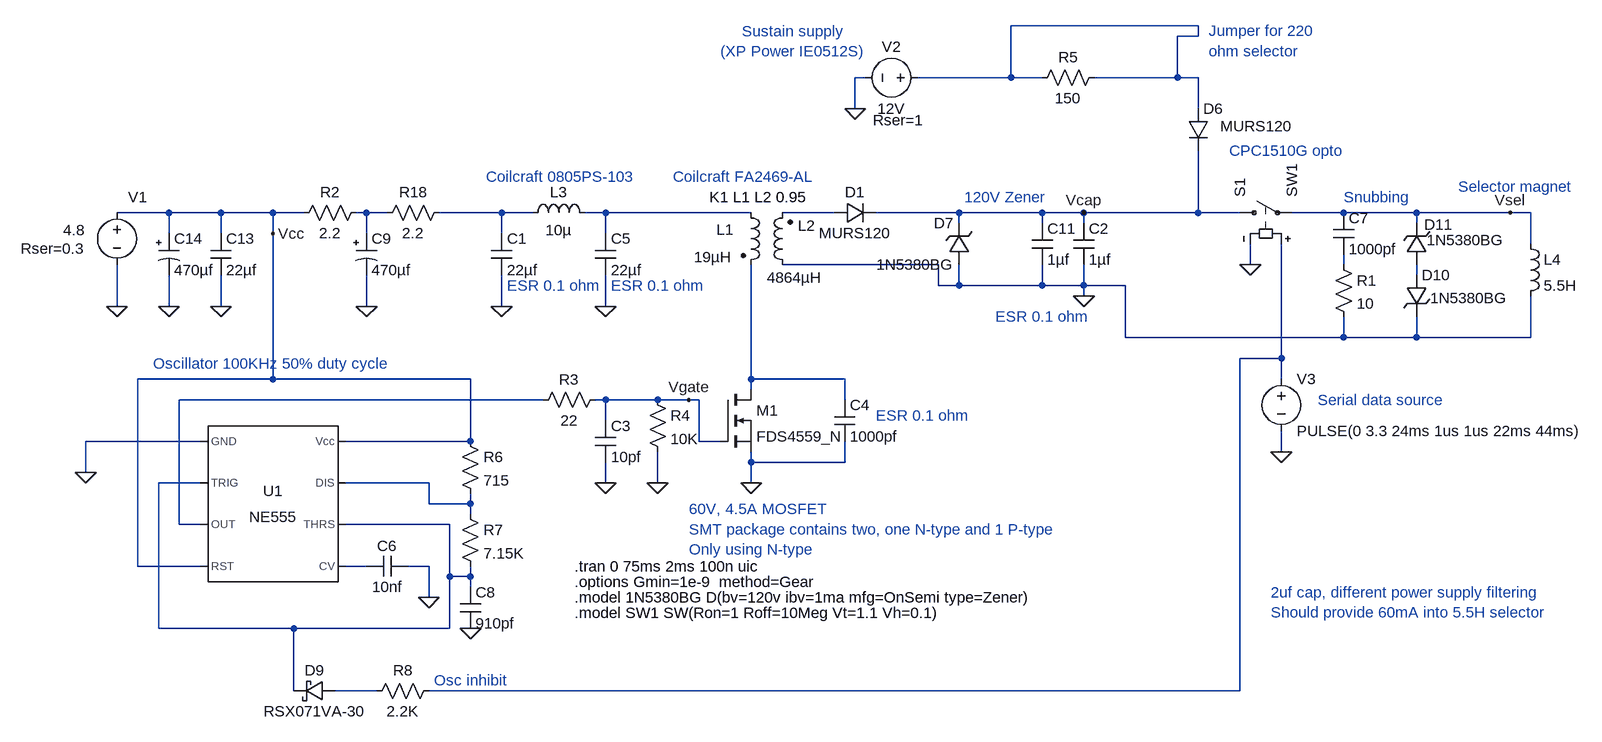
[diagram p0: schematic ttydriver.asc]
ttydriver.asc, the LTspice schematic file:
Version 4
SHEET 1 1932 744
WIRE 1264 -384 976 -384
WIRE 1264 -368 1264 -384
WIRE 1264 -368 1232 -368
WIRE 752 -304 736 -304
WIRE 976 -304 976 -384
WIRE 976 -304 832 -304
WIRE 1024 -304 976 -304
WIRE 1232 -304 1232 -368
WIRE 1232 -304 1104 -304
WIRE 1264 -304 1232 -304
WIRE 736 -256 736 -304
WIRE 1264 -256 1264 -304
WIRE -320 -96 -400 -96
WIRE -240 -96 -320 -96
WIRE -160 -96 -240 -96
WIRE -112 -96 -160 -96
WIRE -16 -96 -32 -96
WIRE 16 -96 -16 -96
WIRE 192 -96 96 -96
WIRE 240 -96 192 -96
WIRE 352 -96 320 -96
WIRE 576 -96 352 -96
WIRE 704 -96 624 -96
WIRE 896 -96 768 -96
WIRE 1024 -96 896 -96
WIRE 1088 -96 1024 -96
WIRE 1264 -96 1264 -192
WIRE 1264 -96 1088 -96
WIRE 1328 -96 1264 -96
WIRE 1488 -96 1408 -96
WIRE 1600 -96 1488 -96
WIRE 1744 -96 1600 -96
WIRE 1776 -96 1744 -96
WIRE 896 -80 896 -96
WIRE 1024 -80 1024 -96
WIRE 1088 -80 1088 -96
WIRE 1600 -80 1600 -96
WIRE -320 -64 -320 -96
WIRE -240 -64 -240 -96
WIRE -160 -64 -160 -96
WIRE -16 -64 -16 -96
WIRE 192 -64 192 -96
WIRE 352 -64 352 -96
WIRE 1776 -48 1776 -96
WIRE 864 -16 624 -16
WIRE 1344 -16 1344 -48
WIRE 1488 -16 1488 -32
WIRE 1600 0 1600 -16
WIRE 864 16 864 -16
WIRE 896 16 896 -16
WIRE 896 16 864 16
WIRE 1024 16 1024 -16
WIRE 1024 16 896 16
WIRE 1088 16 1088 -16
WIRE 1088 16 1024 16
WIRE 1152 16 1088 16
WIRE 1088 32 1088 16
WIRE -400 48 -400 -16
WIRE -320 48 -320 0
WIRE -240 48 -240 0
WIRE -16 48 -16 0
WIRE 192 48 192 0
WIRE 352 48 352 0
WIRE 1152 96 1152 16
WIRE 1488 96 1488 64
WIRE 1488 96 1152 96
WIRE 1600 96 1600 64
WIRE 1600 96 1488 96
WIRE 1776 96 1776 32
WIRE 1776 96 1600 96
WIRE 1392 128 1392 -48
WIRE 1392 128 1328 128
WIRE -160 160 -160 -64
WIRE -160 160 -368 160
WIRE 144 160 -160 160
WIRE 576 160 576 -16
WIRE 720 160 576 160
WIRE 1392 160 1392 128
WIRE 576 176 576 160
WIRE 256 192 -304 192
WIRE 352 192 336 192
WIRE 432 192 352 192
WIRE 480 192 432 192
WIRE 496 192 480 192
WIRE 720 192 720 160
WIRE 352 224 352 192
WIRE -272 256 -448 256
WIRE 144 256 144 160
WIRE 144 256 -48 256
WIRE 496 256 496 192
WIRE 528 256 496 256
WIRE 1392 272 1392 240
WIRE 576 288 576 272
WIRE 720 288 720 256
WIRE 720 288 576 288
WIRE -448 304 -448 256
WIRE -272 320 -336 320
WIRE 80 320 -48 320
WIRE 352 320 352 288
WIRE 432 320 432 272
WIRE 576 320 576 288
WIRE 80 352 80 320
WIRE 144 352 144 336
WIRE 144 352 80 352
WIRE 144 368 144 352
WIRE -304 384 -304 192
WIRE -272 384 -304 384
WIRE 112 384 -48 384
WIRE -368 448 -368 160
WIRE -272 448 -368 448
WIRE -16 448 -48 448
WIRE 80 448 48 448
WIRE 112 464 112 384
WIRE 144 464 144 448
WIRE 144 464 112 464
WIRE 144 480 144 464
WIRE 80 496 80 448
WIRE -336 544 -336 320
WIRE -128 544 -336 544
WIRE 112 544 112 464
WIRE 112 544 -128 544
WIRE -128 640 -128 544
WIRE 0 640 -64 640
WIRE 1328 640 1328 128
WIRE 1328 640 80 640
FLAG 80 496 0
FLAG -400 48 0
FLAG 1088 32 0
FLAG 1088 -96 Vcap
FLAG 576 320 0
FLAG 352 320 0
FLAG 432 320 0
FLAG 352 48 0
FLAG 192 48 0
FLAG -448 304 0
FLAG 144 544 0
FLAG 1344 -16 0
FLAG 736 -256 0
FLAG 1392 272 0
FLAG 1744 -96 Vsel
FLAG 480 192 Vgate
FLAG -160 -64 Vcc
FLAG -16 48 0
FLAG -320 48 0
FLAG -240 48 0
SYMBOL voltage -400 -112 R0
WINDOW 123 0 0 Left 2
WINDOW 39 -148 71 Left 2
WINDOW 0 17 -8 Left 2
WINDOW 3 -83 43 Left 2
SYMATTR SpiceLine Rser=0.3
SYMATTR InstName V1
SYMATTR Value 4.8
SYMBOL ind2 560 -112 R0
WINDOW 0 -37 42 Left 2
WINDOW 3 -72 84 Left 2
SYMATTR InstName L1
SYMATTR Value 19µH
SYMATTR Type ind
SYMATTR SpiceLine Rser=0.036
SYMBOL ind2 640 0 R180
WINDOW 0 -35 76 Left 2
WINDOW 3 -45 -4 Left 2
SYMATTR InstName L2
SYMATTR Value 4864µH
SYMATTR Type ind
SYMATTR SpiceLine Rser=16.5
SYMBOL diode 704 -80 R270
WINDOW 0 32 32 VTop 2
WINDOW 3 0 32 VBottom 2
SYMATTR InstName D1
SYMATTR Value MURS120
SYMBOL cap 1072 -80 R0
SYMATTR InstName C2
SYMATTR Value 1µf
SYMATTR SpiceLine Rser=0.1
SYMBOL nmos 528 176 R0
SYMATTR InstName M1
SYMATTR Value FDS4559_N
SYMBOL cap 704 192 R0
SYMATTR InstName C4
SYMATTR Value 1000pf
SYMATTR SpiceLine Rser=0.1
SYMBOL res -16 -112 R90
WINDOW 0 0 56 VBottom 2
WINDOW 3 32 56 VTop 2
SYMATTR InstName R2
SYMATTR Value 2.2
SYMBOL res 416 176 R0
SYMATTR InstName R4
SYMATTR Value 10K
SYMBOL res 352 176 R90
WINDOW 0 0 56 VBottom 2
WINDOW 3 32 56 VTop 2
SYMATTR InstName R3
SYMATTR Value 22
SYMBOL cap 336 224 R0
SYMATTR InstName C3
SYMATTR Value 10pf
SYMBOL cap 336 -64 R0
SYMATTR InstName C5
SYMATTR Value 22µf
SYMATTR SpiceLine Rser=0.1
SYMBOL zener 912 -16 R180
WINDOW 0 24 64 Left 2
WINDOW 3 24 0 Left 2
SYMATTR InstName D7
SYMATTR Value 1N5380BG
SYMBOL ind 224 -80 R270
WINDOW 0 32 56 VTop 2
WINDOW 3 5 56 VBottom 2
SYMATTR InstName L3
SYMATTR Value 10µ
SYMATTR SpiceLine Ipk=0.27 Rser=1.2986 Rpar=942 Cpar=0 mfg="Coilcraft" pn="0805PS-103"
SYMBOL cap 176 -64 R0
SYMATTR InstName C1
SYMATTR Value 22µf
SYMATTR SpiceLine Rser=0.1
SYMBOL cap 48 432 R90
WINDOW 0 0 32 VBottom 2
WINDOW 3 32 32 VTop 2
SYMATTR InstName C6
SYMATTR Value 10nf
SYMBOL Misc\\NE555 -160 352 R0
SYMATTR InstName U1
SYMBOL cap 128 480 R0
SYMATTR InstName C8
SYMATTR Value 910pf
SYMBOL res 128 240 R0
SYMATTR InstName R6
SYMATTR Value 715
SYMBOL res 128 352 R0
SYMATTR InstName R7
SYMATTR Value 7.15K
SYMBOL sw 1312 -96 R270
SYMATTR InstName S1
SYMATTR Value SW1
SYMBOL ind 1760 -64 R0
SYMATTR InstName L4
SYMATTR Value 5.5H
SYMATTR SpiceLine Rser=220
SYMBOL cap 1472 -96 R0
SYMATTR InstName C7
SYMATTR Value 1000pf
SYMBOL res 1472 -32 R0
SYMATTR InstName R1
SYMATTR Value 10
SYMBOL diode 1248 -256 R0
WINDOW 3 50 27 Left 2
SYMATTR Value MURS120
SYMATTR InstName D6
SYMBOL schottky -64 624 R90
WINDOW 0 0 32 VBottom 2
WINDOW 3 32 32 VTop 2
SYMATTR InstName D9
SYMATTR Value RSX071VA-30
SYMATTR Description Diode
SYMATTR Type diode
SYMBOL voltage 848 -304 R90
WINDOW 0 -32 56 VBottom 2
WINDOW 3 32 56 VTop 2
WINDOW 123 0 0 Left 2
WINDOW 39 81 45 VBottom 2
SYMATTR InstName V2
SYMATTR Value 12V
SYMATTR SpiceLine Rser=1
SYMBOL res 1120 -320 R90
WINDOW 0 0 56 VBottom 2
WINDOW 3 32 56 VTop 2
SYMATTR InstName R5
SYMATTR Value 150
SYMBOL voltage 1392 144 R0
WINDOW 123 0 0 Left 2
WINDOW 39 0 0 Left 2
SYMATTR InstName V3
SYMATTR Value PULSE(0 3.3 24ms 1us 1us 22ms 44ms)
SYMBOL res 96 624 R90
WINDOW 0 0 56 VBottom 2
WINDOW 3 32 56 VTop 2
SYMATTR InstName R8
SYMATTR Value 2.2K
SYMBOL zener 1584 0 R0
WINDOW 3 37 35 Left 2
SYMATTR Value 1N5380BG
SYMATTR InstName D10
SYMBOL zener 1616 -16 R180
WINDOW 0 -40 62 Left 2
WINDOW 3 -119 38 Left 2
SYMATTR InstName D11
SYMATTR Value 1N5380BG
SYMBOL polcap -32 -64 R0
SYMATTR InstName C9
SYMATTR Value 470µf
SYMATTR SpiceLine Rser=2
SYMBOL polcap -336 -64 R0
SYMATTR InstName C14
SYMATTR Value 470µf
SYMATTR SpiceLine Rser=2
SYMBOL cap 1008 -80 R0
SYMATTR InstName C11
SYMATTR Value 1µf
SYMATTR SpiceLine Rser=0.1
SYMBOL res 112 -112 R90
WINDOW 0 0 56 VBottom 2
WINDOW 3 32 56 VTop 2
SYMATTR InstName R18
SYMATTR Value 2.2
SYMBOL cap -256 -64 R0
SYMATTR InstName C13
SYMATTR Value 22µf
SYMATTR SpiceLine Rser=0.1
TEXT 304 448 Left 2 !.tran 0 75ms 2ms 100n uic
TEXT 304 472 Left 2 !.options Gmin=1e-9  method=Gear
TEXT 512 -120 Left 2 !K1 L1 L2 0.95
TEXT 456 -152 Left 2 ;Coilcraft FA2469-AL
TEXT 952 64 Left 2 ;ESR 0.1 ohm
TEXT 480 360 Left 2 ;60V, 4.5A MOSFET\nSMT package contains two, one N-type and 1 P-type\nOnly using N-type
TEXT 360 16 Left 2 ;ESR 0.1 ohm
TEXT 768 216 Left 2 ;ESR 0.1 ohm
TEXT 304 496 Left 2 !.model 1N5380BG D(bv=120v ibv=1ma mfg=OnSemi type=Zener)
TEXT 904 -120 Left 2 ;120V Zener
TEXT 200 16 Left 2 ;ESR 0.1 ohm
TEXT 168 -152 Left 2 ;Coilcraft 0805PS-103
TEXT 304 520 Left 2 !.model SW1 SW(Ron=1 Roff=10Meg Vt=1.1 Vh=0.1)
TEXT 1664 -136 Left 2 ;Selector magnet
TEXT 640 -360 Center 2 ;Sustain supply\n(XP Power IE0512S)
TEXT 1448 192 Left 2 ;Serial data source
TEXT 88 624 Left 2 ;Osc inhibit
TEXT 1312 -192 Left 2 ;CPC1510G opto
TEXT 1488 -120 Left 2 ;Snubbing
TEXT -344 136 Left 2 ;Oscillator 100KHz 50% duty cycle
TEXT 1280 -376 Left 2 ;Jumper for 220\nohm selector
TEXT 1376 488 Left 2 ;2uf cap, different power supply filtering\nShould provide 60mA into 5.5H selector

The netlist it stands for:
* ttydriver.asc
V1 Vcc 0 4.8 Rser=0.3
L1 N004 N009 19µH Rser=0.036
L2 0 N005 4864µH Rser=16.5
D1 N005 Vcap MURS120
C2 Vcap 0 1µf Rser=0.1
M1 N009 Vgate 0 0 FDS4559_N
C4 N009 0 1000pf Rser=0.1
R2 N002 Vcc 2.2
R4 Vgate 0 10K
R3 Vgate N010 22
C3 Vgate 0 10pf
C5 N004 0 22µf Rser=0.1
D7 0 Vcap 1N5380BG
L3 N003 N004 10µ Ipk=0.27 Rser=1.2986 Rpar=942 Cpar=0 mfg="Coilcraft" pn="0805PS-103"
C1 N003 0 22µf Rser=0.1
C6 0 N013 10nf
XU1 0 N011 N010 Vcc N013 N011 N012 Vcc NE555  ; pins GND TRIG OUT RST CV THRS DIS Vcc
C8 N011 0 910pf
R6 Vcc N012 715
R7 N012 N011 7.15K
S1 Vcap Vsel N008 0 SW1
L4 Vsel 0 5.5H Rser=220
C7 Vsel N006 1000pf
R1 N006 0 10
D6 N001 Vcap MURS120
D9 N014 N011 RSX071VA-30
V2 N001 0 12V Rser=1
R5 N001 N001 150
V3 N008 0 PULSE(0 3.3 24ms 1us 1us 22ms 44ms)
R8 N008 N014 2.2K
D10 N007 0 1N5380BG
D11 N007 Vsel 1N5380BG
C9 N002 0 470µf Rser=2
C14 Vcc 0 470µf Rser=2
C11 Vcap 0 1µf Rser=0.1
R18 N003 N002 2.2
C13 Vcc 0 22µf Rser=0.1
.model D D
.lib standard.dio
.model NMOS NMOS
.model PMOS PMOS
.lib standard.mos
.tran 0 75ms 2ms 100n uic
.options Gmin=1e-9  method=Gear
K1 L1 L2 0.95
* Coilcraft FA2469-AL
* ESR 0.1 ohm
* 60V, 4.5A MOSFET
* SMT package contains two, one N-type and 1 P-type
* Only using N-type
* ESR 0.1 ohm
* ESR 0.1 ohm
.model 1N5380BG D(bv=120v ibv=1ma mfg=OnSemi type=Zener)
* 120V Zener
* ESR 0.1 ohm
* Coilcraft 0805PS-103
.model SW1 SW(Ron=1 Roff=10Meg Vt=1.1 Vh=0.1)
* Selector magnet
* Sustain supply
* (XP Power IE0512S)
* Serial data source
* Osc inhibit
* CPC1510G opto
* Snubbing
* Oscillator 100KHz 50% duty cycle
* Jumper for 220
* ohm selector
* 2uf cap, different power supply filtering
* Should provide 60mA into 5.5H selector
.lib NE555.sub
.backanno
.end